# Altium schematic sheet TOP.SchDoc
size Letter; SheetNumber: 1; SheetTotal: 4
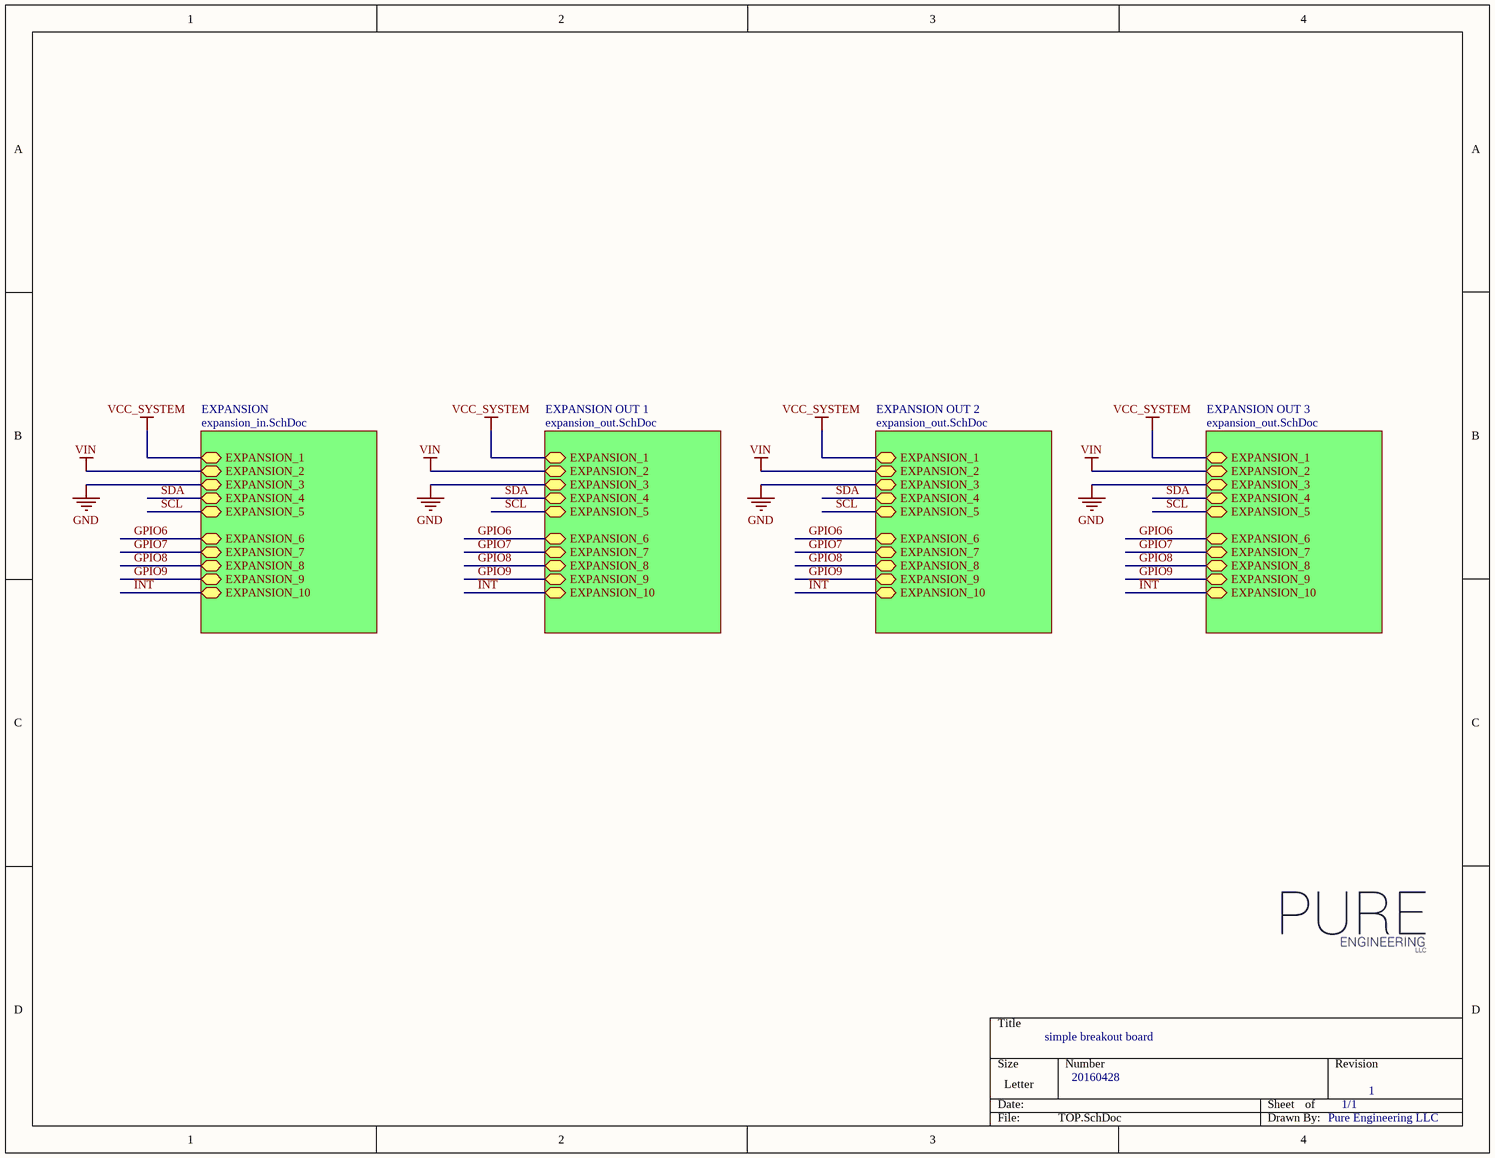
[diagram p0: TOP.SchDoc]

## Sub-sheets
EXPANSION = expansion_in.SchDoc: EXPANSION_1, EXPANSION_2, EXPANSION_3, EXPANSION_4, EXPANSION_5, EXPANSION_10, EXPANSION_9, EXPANSION_8, EXPANSION_7, EXPANSION_6
EXPANSION OUT 1 = expansion_out.SchDoc: EXPANSION_1, EXPANSION_2, EXPANSION_3, EXPANSION_4, EXPANSION_5, EXPANSION_10, EXPANSION_9, EXPANSION_8, EXPANSION_7, EXPANSION_6
EXPANSION OUT 2 = expansion_out.SchDoc: EXPANSION_1, EXPANSION_2, EXPANSION_3, EXPANSION_4, EXPANSION_5, EXPANSION_10, EXPANSION_9, EXPANSION_8, EXPANSION_7, EXPANSION_6
EXPANSION OUT 3 = expansion_out.SchDoc: EXPANSION_1, EXPANSION_2, EXPANSION_3, EXPANSION_4, EXPANSION_5, EXPANSION_10, EXPANSION_9, EXPANSION_8, EXPANSION_7, EXPANSION_6

## Nets
GND: sheet EXPANSION/EXPANSION_3, sheet EXPANSION OUT 1/EXPANSION_3, sheet EXPANSION OUT 2/EXPANSION_3, sheet EXPANSION OUT 3/EXPANSION_3
VCC_SYSTEM: sheet EXPANSION/EXPANSION_1, sheet EXPANSION OUT 1/EXPANSION_1, sheet EXPANSION OUT 2/EXPANSION_1, sheet EXPANSION OUT 3/EXPANSION_1
VIN: sheet EXPANSION/EXPANSION_2, sheet EXPANSION OUT 1/EXPANSION_2, sheet EXPANSION OUT 2/EXPANSION_2, sheet EXPANSION OUT 3/EXPANSION_2
GPIO6: sheet EXPANSION/EXPANSION_6, sheet EXPANSION OUT 1/EXPANSION_6, sheet EXPANSION OUT 2/EXPANSION_6, sheet EXPANSION OUT 3/EXPANSION_6
GPIO7: sheet EXPANSION/EXPANSION_7, sheet EXPANSION OUT 1/EXPANSION_7, sheet EXPANSION OUT 2/EXPANSION_7, sheet EXPANSION OUT 3/EXPANSION_7
GPIO8: sheet EXPANSION/EXPANSION_8, sheet EXPANSION OUT 1/EXPANSION_8, sheet EXPANSION OUT 2/EXPANSION_8, sheet EXPANSION OUT 3/EXPANSION_8
GPIO9: sheet EXPANSION/EXPANSION_9, sheet EXPANSION OUT 1/EXPANSION_9, sheet EXPANSION OUT 2/EXPANSION_9, sheet EXPANSION OUT 3/EXPANSION_9
~{INT}: sheet EXPANSION/EXPANSION_10, sheet EXPANSION OUT 1/EXPANSION_10, sheet EXPANSION OUT 2/EXPANSION_10, sheet EXPANSION OUT 3/EXPANSION_10
SCL: sheet EXPANSION/EXPANSION_5, sheet EXPANSION OUT 1/EXPANSION_5, sheet EXPANSION OUT 2/EXPANSION_5, sheet EXPANSION OUT 3/EXPANSION_5
SDA: sheet EXPANSION/EXPANSION_4, sheet EXPANSION OUT 1/EXPANSION_4, sheet EXPANSION OUT 2/EXPANSION_4, sheet EXPANSION OUT 3/EXPANSION_4

## Notes on the sheet
- simple breakout board
- 20160428
- 1/1
- 1
- Pure Engineering LLC